# Altium project PCB_NON-CONTACT-THERMOMETER.PrjPcb
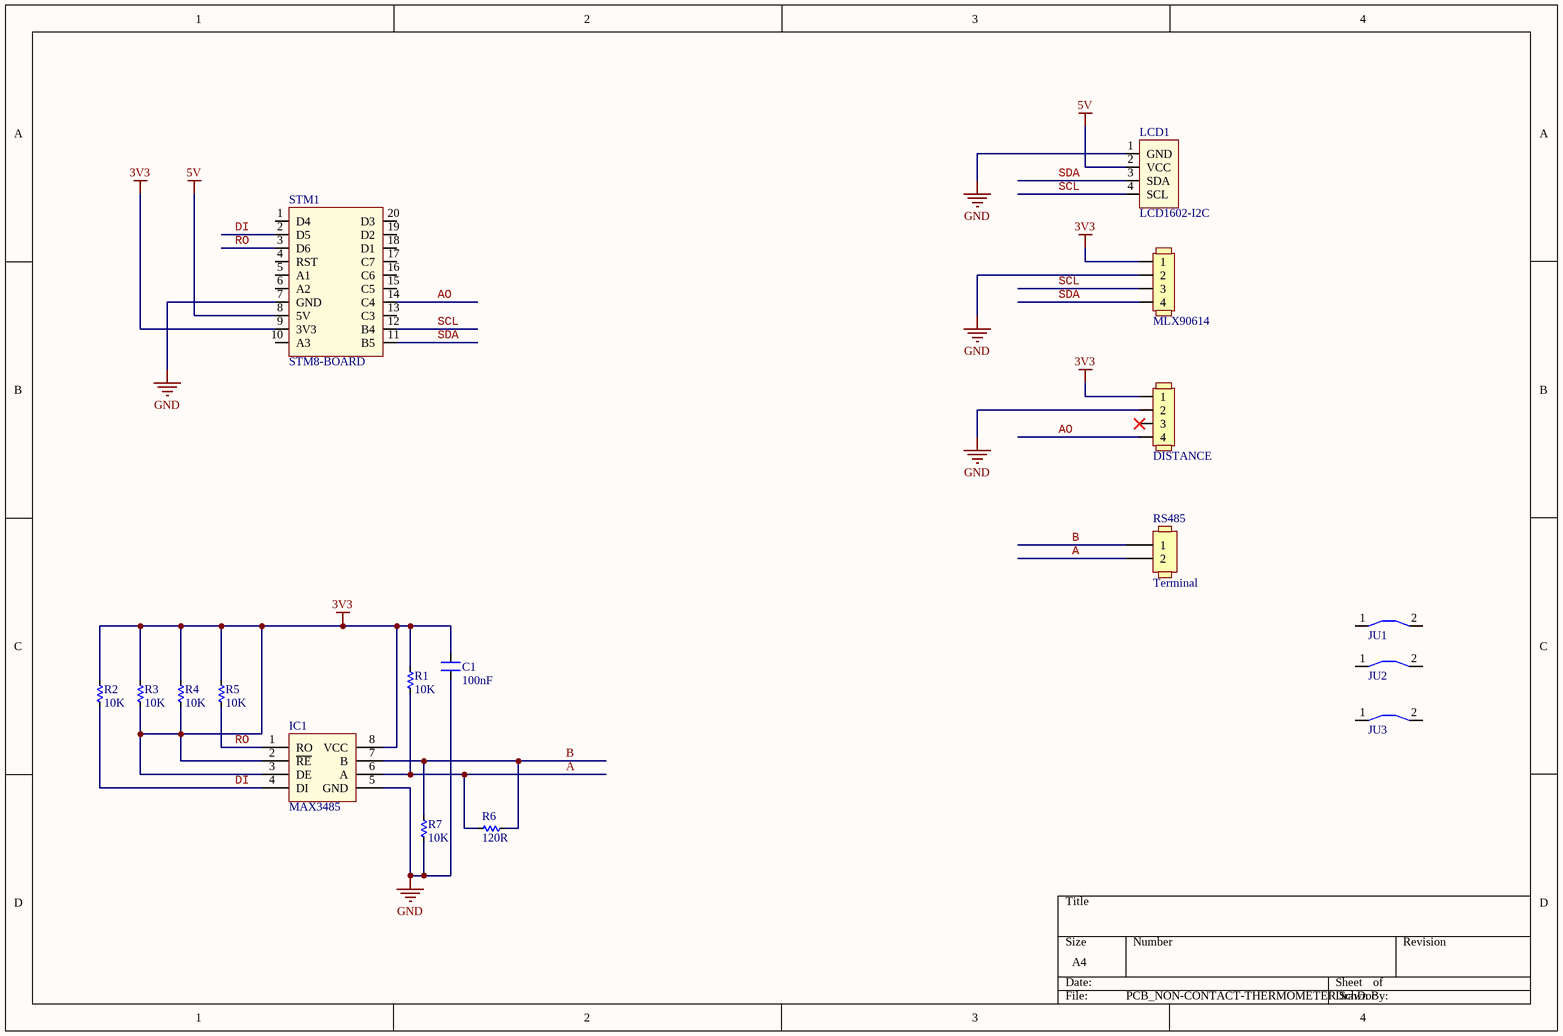
[diagram p0: PCB_NON-CONTACT-THERMOMETER.SchDoc]
1 sheet, 17 parts. Net scope: global (net labels, ports and power ports of the same name join across sheets).
Board file: PCB_NON-CONTACT-THERMOMETER.PcbDoc

## Sheet PCB_NON-CONTACT-THERMOMETER.SchDoc
size A4

### Parts
C1  100nF  [CN1.5]
DISTANCE  Header 4  [HEADER x4]  (value not drawn)
IC1  MAX3485  [DIP8]
JU1  JUMPER  [JUMPER 15MM]  (value not drawn)
JU2  JUMPER  [JUMPER 5MM]  (value not drawn)
JU3  JUMPER  [JUMPER 5MM]  (value not drawn)
LCD1  LCD1602-I2C  [LCD1602-I2C]
MLX90614  Header 4  [HEADER x4]  (value not drawn)
R1  10K  [RES-1/4W]
R2  10K  [RES-1/4W]
R3  10K  [RES-1/4W]
R4  10K  [RES-1/4W]
R5  10K  [RES-1/4W]
R6  120R  [RES-1/4W]
R7  10K  [RES-1/4W]
RS485  Terminal  [Terminal x2 5mm]
STM1  STM8-BOARD  [STM8-BOARD]

### Nets
3V3: C1.2 DISTANCE.1 IC1.2(~{RE}) IC1.3(DE) IC1.8(VCC) MLX90614.1 R1.1 R2.1 R3.1 R3.2 R4.1 R4.2 R5.1 STM1.9(3V3)
5V: LCD1.2(VCC) STM1.8(5V)
GND: C1.1 DISTANCE.2 IC1.5(GND) LCD1.1(GND) MLX90614.2 R7.2 STM1.7(GND)
A: IC1.6(A) R1.2 R6.1 RS485.2
AO: DISTANCE.4 STM1.14(C4)
B: IC1.7(B) R6.2 R7.1 RS485.1
DI: IC1.4(DI) R2.2 STM1.2(D5)
RO: IC1.1(RO) R5.2 STM1.3(D6)
SCL: LCD1.4(SCL) MLX90614.3 STM1.12(B4)
SDA: LCD1.3(SDA) MLX90614.4 STM1.11(B5)

Not connected (* = marked no-connect by the designer): DISTANCE 3*; JU1 1 2; JU2 1 2; JU3 1 2; STM1 1(D4) 4(RST) 5(A1) 6(A2) 10(A3) 13(C3) 15(C5) 16(C6) 17(C7) 18(D1) 19(D2) 20(D3)

### Library data of the parts
C1 = CN: Value: 33pF
IC1 = MAX485: RS232 - RS485 (Same sn75176)
R1-R7 = Res: Manufacturer: Generic Components; Class: Passive; SubClass: R; Published: 08/06/2000; Publisher: Altium Hobart Technology Centre
RS485 = Terminal x2